# Altium schematic sheet LED_RGB.SchDoc: LED RGB
size A3; Author: Silvio Navaretti; CompanyName: ARDUINO; DrawnBy: Silvio Navaretti; Engineer: Silvio Navaretti; Organization: ARDUINO; SheetNumber: 16; SheetTotal: 51; RevAuthor: Silvio Navaretti
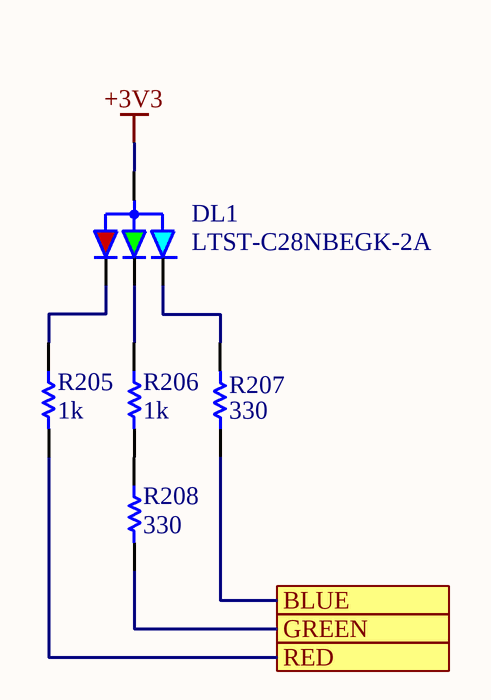
[diagram p0: LED_RGB.SchDoc]

## Parts
DL1  LTST-C28NBEGK-2A  [SMLP34RGB2W]
R205  value 1k  [RES-0201]  (hidden comment: RC0201FR-071KL)
R206  value 1k  [RES-0201]  (hidden comment: RC0201FR-071KL)
R207  value 330  [RES-0201]  (hidden comment: AC0201FR-07330RL)
R208  value 330  [RES-0201]  (hidden comment: AC0201FR-07330RL)

## Ports
BLUE, GREEN, RED

## Nets
+3V3: DL1.1(ANODE)
BLUE: R207.1 ; port BLUE
GREEN: R208.2 ; port GREEN
RED: R205.2 ; port RED
NetDL1_2: DL1.2(RED_C) R205.1
NetDL1_3: DL1.3(BLUE_C) R207.2
NetDL1_4: DL1.4(GREEN_C) R206.1
NetR206_2: R206.2 R208.1

## Notes on the sheet
- Title:
- ID:
- Date:
- Time:
- Version:
- Sheet
- of
- RevAuthor:
- Reference Designs ARE PROVIDED "AS IS" AND "WITH ALL FAULTS. Arduino SA DISCLAIMS ALL OTHER WARRANTIES, EXPRESS OR IMPLIED, REGARDING PRODUCTS, INCLUDING BUT NOT LIMITED TO, ANY IMPLIED WARRANTIES OF MERCHANTABILITY OR FITNESS FOR A PARTICULAR PURPOSE.
  Arduino SA may make changes to specifications and product descriptions at any time, without notice. The Customer must not rely on the absence or characteristics of any features or instructions marked "reserved" or "undefined".
  Arduino SA reserves these for future definition and shall have no responsibility whatsoever for conflicts or incompatibilities arising from future changes to them. The product information on the Web Site or Materials is subject to change without notice.
  Do not finalize a design with this info. ARDUINO and other Arduino brands and logos and Trademarks of Arduino SA. All Arduino SA Trademarks cannot be used without owner's formal permission.
- File:
- Author:

## Library data of the parts
DL1 = L0014-A.13: LED RGB DIFFUSED PICOLED SMD; Manufacturer: Liteon; Dominant Wavelength: 470nm; Forward Current: 20mA; Code Arduino: A5469; Luminous Intensity: 45mcd; Forward Voltage: 3V; Lens Color: White; Lens Style: Rectangular; Test Current: 5mA; Length: 1mm; Color: Blue,Green,Red; Part Number: LTST-C28NBEGK-2A; Width: 1mm; Pin Count: 4; Lens Transparency: Diffused; Case Code (Imperial): 0404; Min Operating Temperature: -40°C; Height: 0.25mm; Max Operating Temperature: 85°C
R205 R206 = R0195-A.22: RES CHIP 0201 1k 1% 1/20W; Manufacturer: Yageo; Power: 50mW; Temperature coefficient: 200ppm; Code Arduino: R0195; Part Number: RC0201FR-071KL; Tolerance: 1%; Case Code (Imperial): 0201; Technology: Thick film
R207 = R0149-A.21: RES CHIP 0201 330R 1% 1/20W; Manufacturer: Yageo; Power: 50mW; Code Arduino: R0149; Temperature coefficient: 200ppm; Case Code (Imperial): 0201; Manufacturer 2: Samsung Electro-Mechanics; Tolerance: 1%; Part Number: AC0201FR-07330RL; Technology: Thick film
R208 = R0149-A.21: RES CHIP 0201 330R 1% 1/20W; Manufacturer: Yageo; Power: 50mW; Temperature coefficient: 200ppm; Code Arduino: R0149; Part Number: AC0201FR-07330RL; Tolerance: 1%; Case Code (Imperial): 0201; Technology: Thick film; Manufacturer 2: Samsung Electro-Mechanics